# Altium schematic sheet BLDC-CONTROLLET.SchDoc
size 420 x 297 mm; ApprovedBy: Бакан; CheckedBy: Зарецкий; DrawnBy: Войтенко; DocumentNumber: АБВГ.000000.000 Э3; SheetNumber: 1; SheetTotal: 5; PageSetup: Record=PageOptions|CenterHorizontal=False|CenterVertical=False|PrintScale=0.95|XCorrection=0.00|YCorrection=0.00|PrintKind=1|BorderSize=5000000|LeftOffset=0|BottomOffset=0|Orientation=1|PaperLength=1000|PaperWidth=1000|Scale=100|PaperSource=15|PrintQuality=600|MediaType=1|DitherType=10|PaperKind=A4|PrintScaleMode=1; DocumentType: Схема электрическая принципиальная; Developer1size1str: ООО ЛАЦИТ; Title1size1str: Плата контроллера
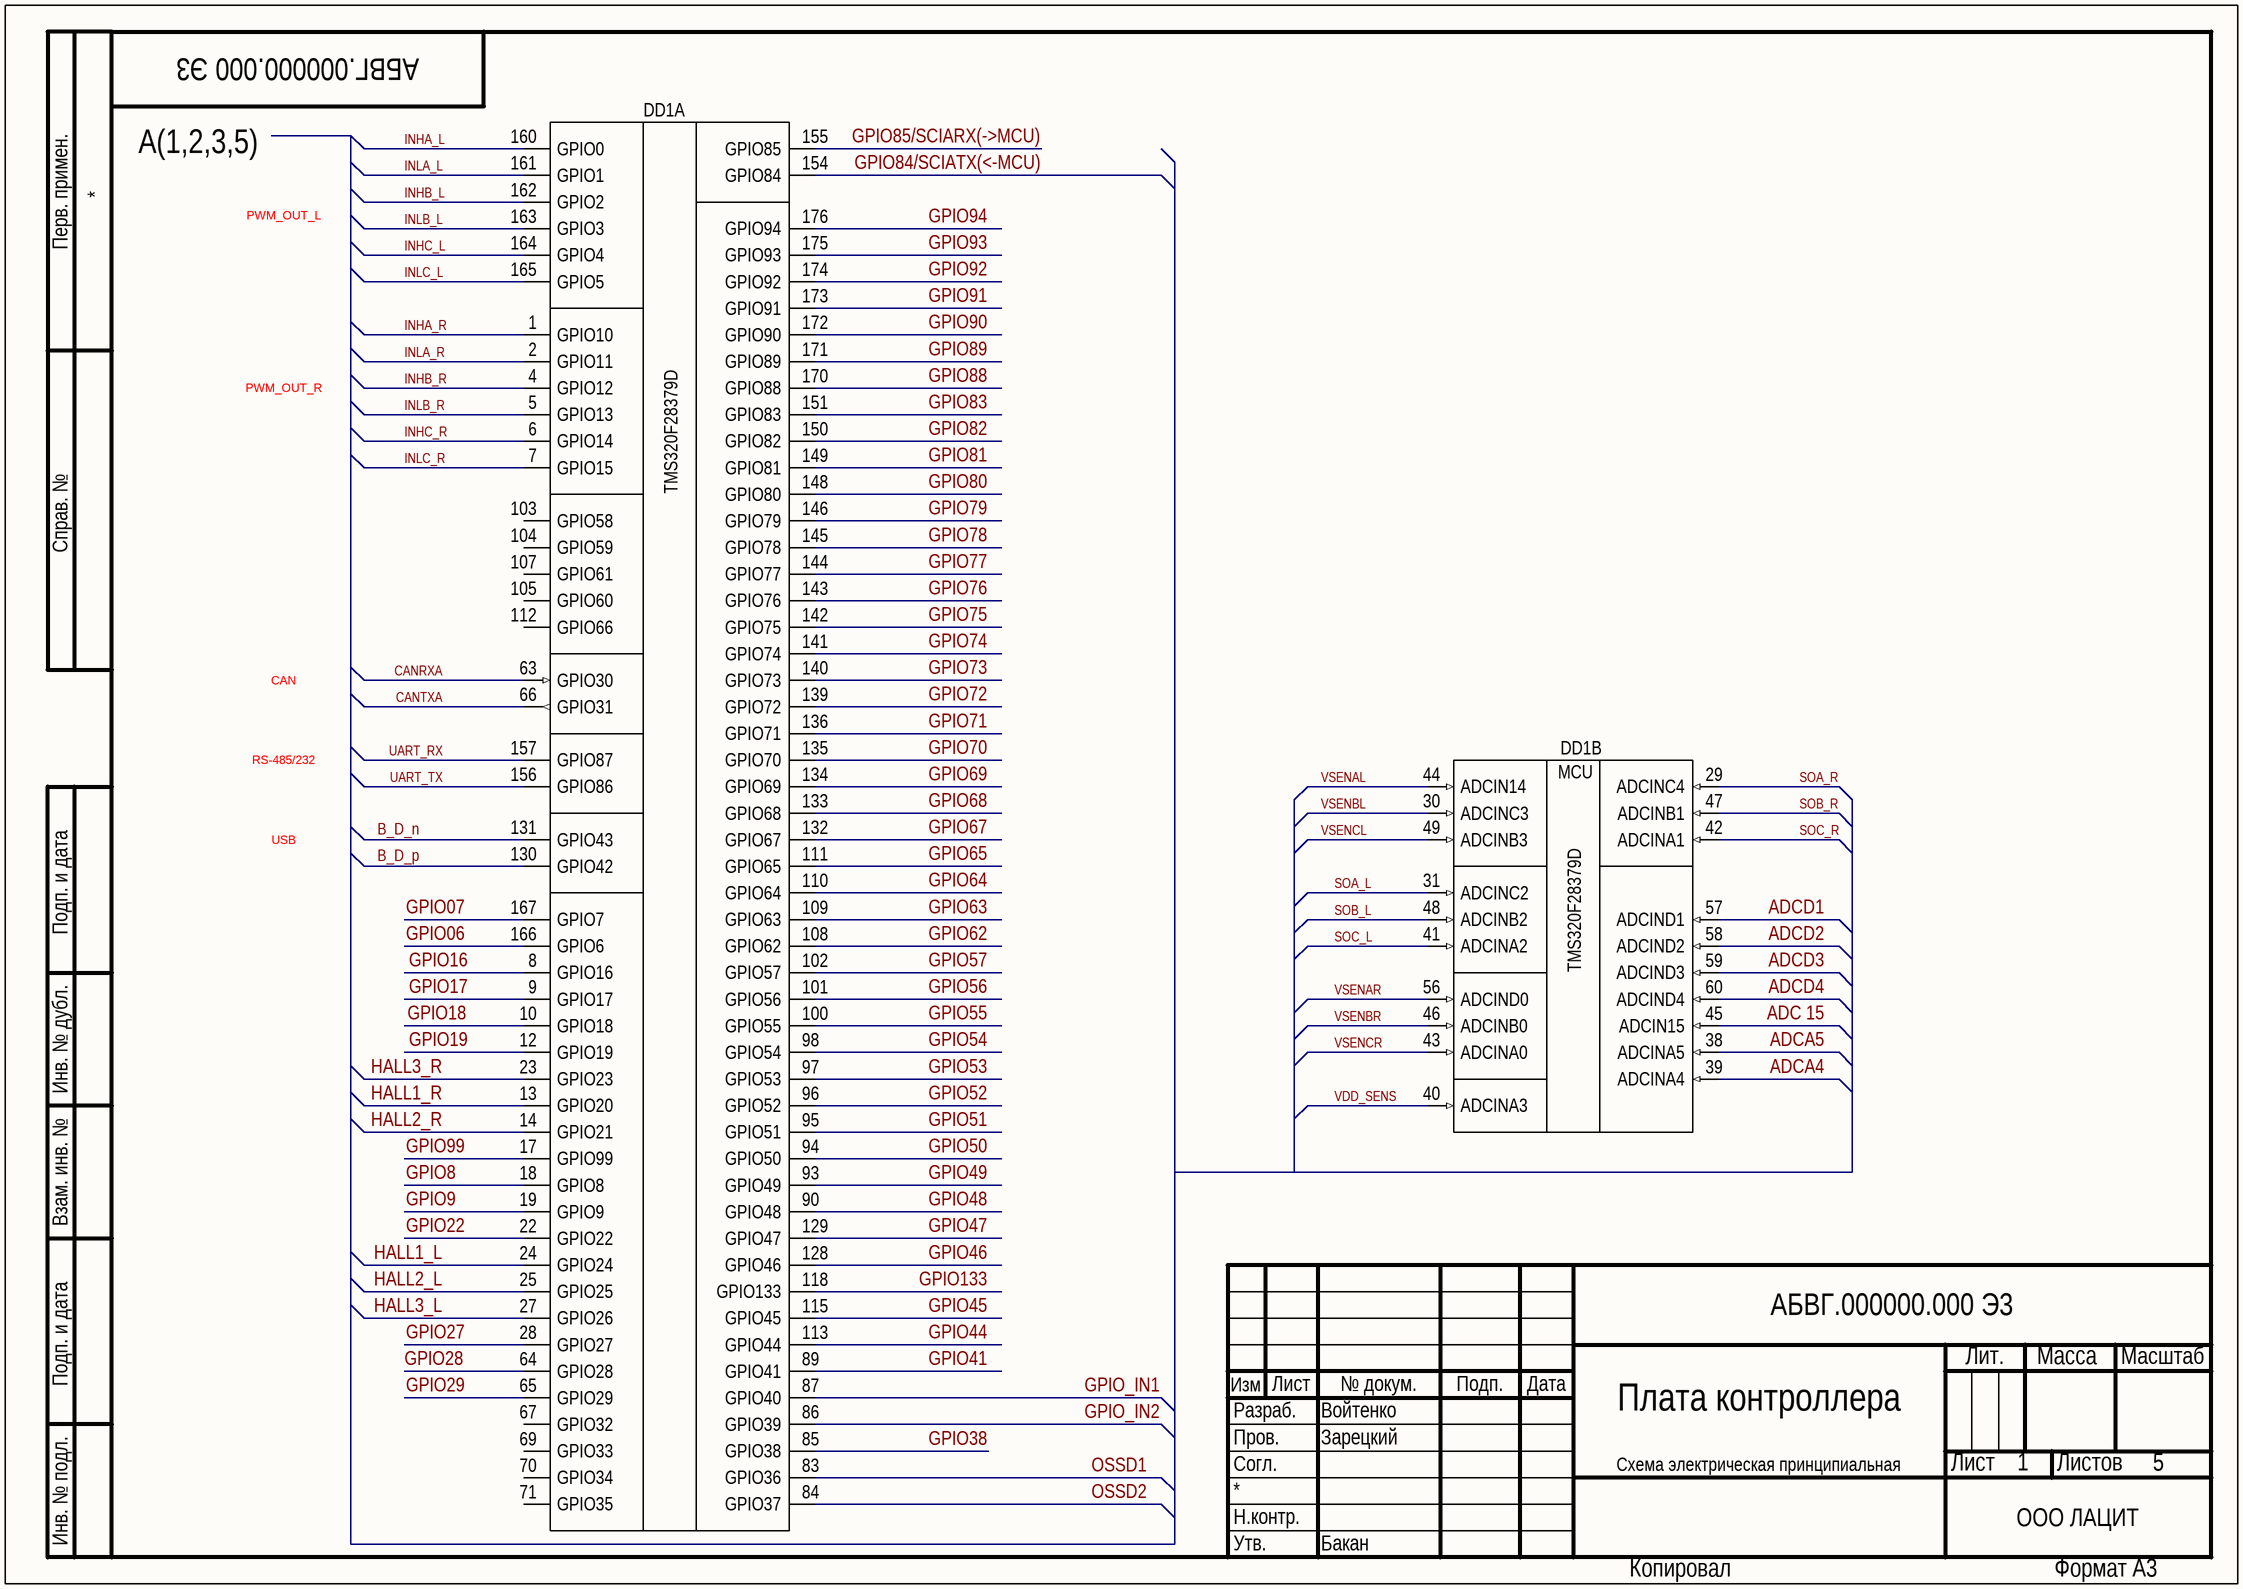
[diagram p0: BLDC-CONTROLLET.SchDoc]

## Parts
DD1  TMS320F28379DPTP_LACID  [176-HLQFP]  (value not drawn)  (parts A,B of 3)

## Nets
ADC 15: DD1.45(ADCIN15)
ADCA4: DD1.39(ADCINA4)
ADCA5: DD1.38(ADCINA5)
ADCD1: DD1.57(ADCIND1)
ADCD2: DD1.58(ADCIND2)
ADCD3: DD1.59(ADCIND3)
ADCD4: DD1.60(ADCIND4)
B_D_n: DD1.131(GPIO43)
B_D_p: DD1.130(GPIO42)
CANRXA: DD1.63(GPIO30)
CANTXA: DD1.66(GPIO31)
GPIO06: DD1.166(GPIO6)
GPIO07: DD1.167(GPIO7)
GPIO8: DD1.18(GPIO8)
GPIO9: DD1.19(GPIO9)
GPIO16: DD1.8(GPIO16)
GPIO17: DD1.9(GPIO17)
GPIO18: DD1.10(GPIO18)
GPIO19: DD1.12(GPIO19)
GPIO22: DD1.22(GPIO22)
GPIO27: DD1.28(GPIO27)
GPIO28: DD1.64(GPIO28)
GPIO29: DD1.65(GPIO29)
GPIO38: DD1.85(GPIO38)
GPIO41: DD1.89(GPIO41)
GPIO44: DD1.113(GPIO44)
GPIO45: DD1.115(GPIO45)
GPIO46: DD1.128(GPIO46)
GPIO47: DD1.129(GPIO47)
GPIO48: DD1.90(GPIO48)
GPIO49: DD1.93(GPIO49)
GPIO50: DD1.94(GPIO50)
GPIO51: DD1.95(GPIO51)
GPIO52: DD1.96(GPIO52)
GPIO53: DD1.97(GPIO53)
GPIO54: DD1.98(GPIO54)
GPIO55: DD1.100(GPIO55)
GPIO56: DD1.101(GPIO56)
GPIO57: DD1.102(GPIO57)
GPIO62: DD1.108(GPIO62)
GPIO63: DD1.109(GPIO63)
GPIO64: DD1.110(GPIO64)
GPIO65: DD1.111(GPIO65)
GPIO67: DD1.132(GPIO67)
GPIO68: DD1.133(GPIO68)
GPIO69: DD1.134(GPIO69)
GPIO70: DD1.135(GPIO70)
GPIO71: DD1.136(GPIO71)
GPIO72: DD1.139(GPIO72)
GPIO73: DD1.140(GPIO73)
GPIO74: DD1.141(GPIO74)
GPIO75: DD1.142(GPIO75)
GPIO76: DD1.143(GPIO76)
GPIO77: DD1.144(GPIO77)
GPIO78: DD1.145(GPIO78)
GPIO79: DD1.146(GPIO79)
GPIO80: DD1.148(GPIO80)
GPIO81: DD1.149(GPIO81)
GPIO82: DD1.150(GPIO82)
GPIO83: DD1.151(GPIO83)
GPIO84/SCIATX(<-MCU): DD1.154(GPIO84)
GPIO85/SCIARX(->MCU): DD1.155(GPIO85)
GPIO88: DD1.170(GPIO88)
GPIO89: DD1.171(GPIO89)
GPIO90: DD1.172(GPIO90)
GPIO91: DD1.173(GPIO91)
GPIO92: DD1.174(GPIO92)
GPIO93: DD1.175(GPIO93)
GPIO94: DD1.176(GPIO94)
GPIO99: DD1.17(GPIO99)
GPIO133: DD1.118(GPIO133)
GPIO_IN1: DD1.87(GPIO40)
GPIO_IN2: DD1.86(GPIO39)
HALL1_L: DD1.24(GPIO24)
HALL1_R: DD1.13(GPIO20)
HALL2_L: DD1.25(GPIO25)
HALL2_R: DD1.14(GPIO21)
HALL3_L: DD1.27(GPIO26)
HALL3_R: DD1.23(GPIO23)
INHA_L: DD1.160(GPIO0)
INHA_R: DD1.1(GPIO10)
INHB_L: DD1.162(GPIO2)
INHB_R: DD1.4(GPIO12)
INHC_L: DD1.164(GPIO4)
INHC_R: DD1.6(GPIO14)
INLA_L: DD1.161(GPIO1)
INLA_R: DD1.2(GPIO11)
INLB_L: DD1.163(GPIO3)
INLB_R: DD1.5(GPIO13)
INLC_L: DD1.165(GPIO5)
INLC_R: DD1.7(GPIO15)
OSSD1: DD1.83(GPIO36)
OSSD2: DD1.84(GPIO37)
SOA_L: DD1.31(ADCINС2)
SOA_R: DD1.29(ADCINC4)
SOB_L: DD1.48(ADCINB2)
SOB_R: DD1.47(ADCINB1)
SOC_L: DD1.41(ADCINA2)
SOC_R: DD1.42(ADCINA1)
UART_RX: DD1.157(GPIO87)
UART_TX: DD1.156(GPIO86)
VDD_SENS: DD1.40(ADCINA3)
VSENAL: DD1.44(ADCIN14)
VSENAR: DD1.56(ADCIND0)
VSENBL: DD1.30(ADCINC3)
VSENBR: DD1.46(ADCINB0)
VSENCL: DD1.49(ADCINB3)
VSENCR: DD1.43(ADCINA0)

Not connected (* = marked no-connect by the designer): DD1 67(GPIO32) 69(GPIO33) 70(GPIO34) 71(GPIO35) 103(GPIO58) 104(GPIO59) 105(GPIO60) 107(GPIO61) 112(GPIO66)

## Notes on the sheet
- А(1,2,3,5)
- PWM_OUT_L
- PWM_OUT_R
- CAN
- RS-485/232
- USB
- Перв. примен.
- Справ. №
- Подп. и дата
- Инв. № дубл.
- Взам. инв. №
- Изм
- Лист
- № докум.
- Подп.
- Дата
- Лит.
- Масса
- Масштаб
- Пров.
- Согл.
- Разраб.
- Листов
- Инв. № подл.
- Н.контр.
- Утв.
- Копировал
- Формат А3
- (in symbol TMS320F28379DPTP_LACID, part A) TMS320F28379D
- (in symbol TMS320F28379DPTP_LACID, part B) MCU; TMS320F28379D

## Library data of the parts
DD1 = TMS320F28379DPTP_LACID: PartNumber: TMS320F28379DPTPT; Case: HLQFP-176